# Altium schematic sheet [03] SM 1222 DQ8 x relay.SchDoc
size 101 x 76 mm
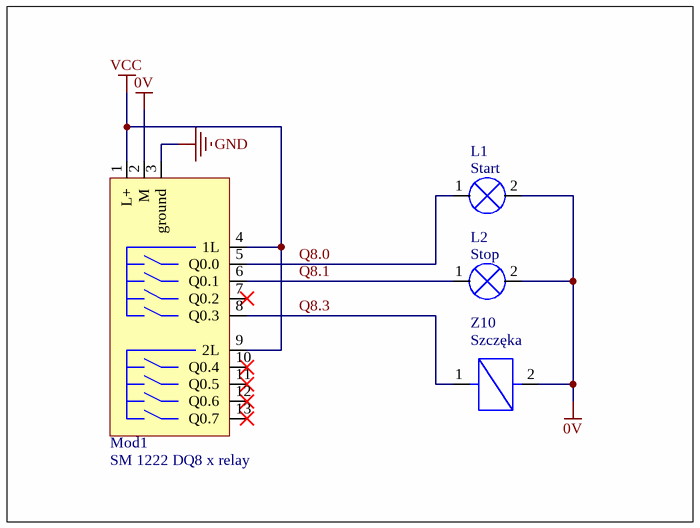
[diagram p0: [03] SM 1222 DQ8 x relay.SchDoc]

## Parts
L1  Start
L2  Stop
Mod1  SM 1222 DQ8 x relay
Z10  Szczęka

## Nets
0V: L1.2 L2.2 Mod1.2(M) Z10.2
GND: Mod1.3(ground)
VCC: Mod1.1(L+) Mod1.4(1L) Mod1.9(2L)
Q8.0: L1.1 Mod1.5(Q0.0)
Q8.1: L2.1 Mod1.6(Q0.1)
Q8.3: Mod1.8(Q0.3) Z10.1

Not connected (* = marked no-connect by the designer): Mod1 7(Q0.2)* 10(Q0.4)* 11(Q0.5)* 12(Q0.6)* 13(Q0.7)*

## Library data of the parts
L1 L2 = Light
Z10 = Coil